# EAGLE design brick_i2c_battery (EAGLE 7.2.0)
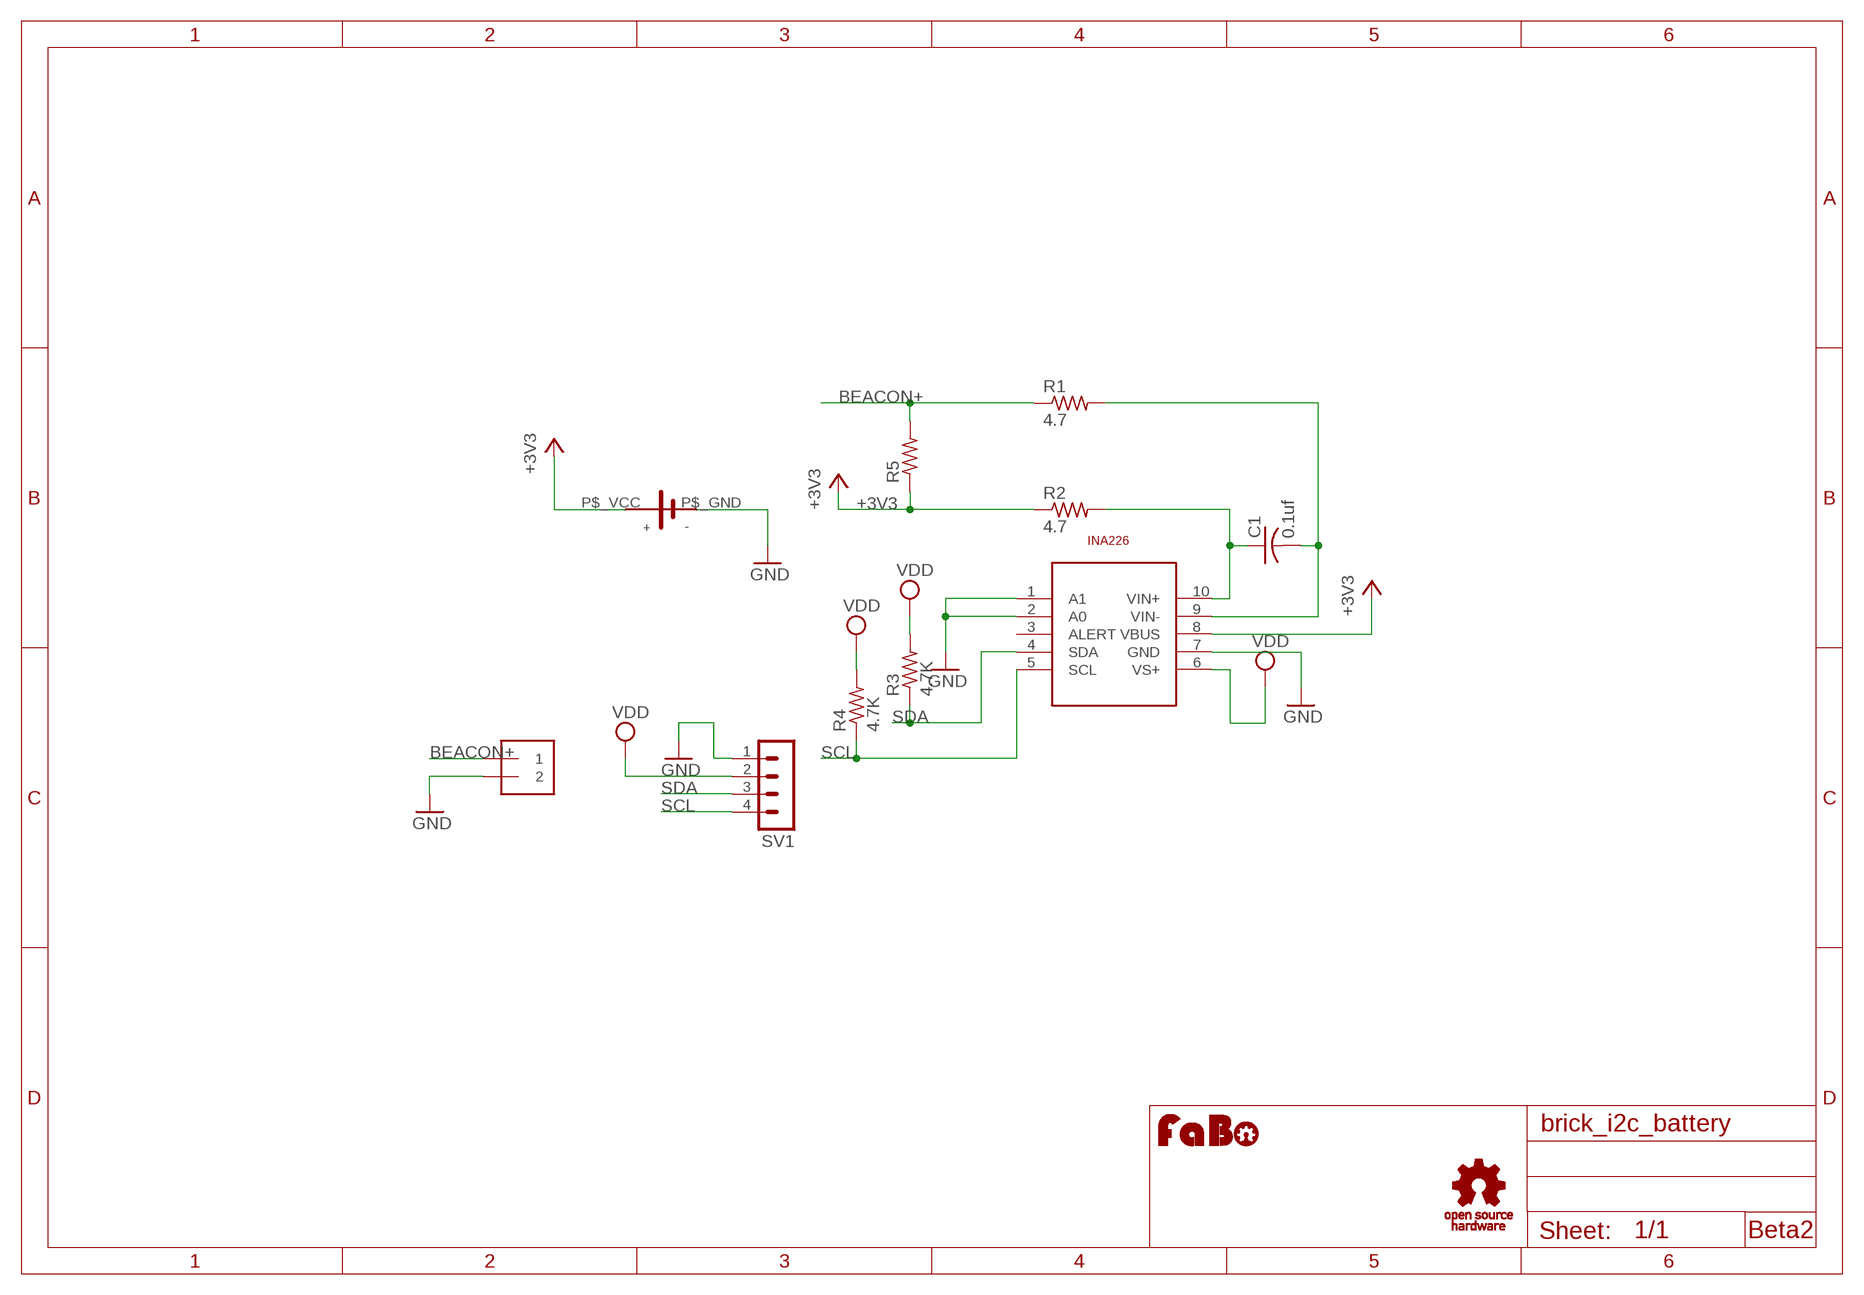
[diagram p0: schematic, sheet 1]

## Parts
C1  0.1uf  C-USC0603  [C0603]
INA1  TI-INA226  [TI-INA226]
J1  1X2-3.5MM  [1X2-3.5MM]
R1  4.7  R-US_R0603  [R0603]
R2  4.7  R-US_R0603  [R0603]
R3  4.7K  R-US_R0603  [R0603]
R4  4.7K  R-US_R0603  [R0603]
R5  R-US_R6332  [R6332]
SV1  MA04-1  [MA04-1]
U$2  SMTU2450  [SMTU2450]
U$3  LOGO_FABO-S  [LOGO_FABO_S]
U$4  LOGO_OSHW_T-S  [LOGO_OSHW_T_S]

## Nets
+3V3: INA1.8(VBUS) R2.1 R5.1 U$2.P$_VCC
BEACON+: J1.1 R1.1 R5.2
GND: INA1.1(A1) INA1.2(A0) INA1.7(GND) J1.2 SV1.1 U$2.P$_GND
N$3: C1.1 INA1.10(VIN+) R2.2
N$4: C1.2 INA1.9(VIN-) R1.2
SCL: INA1.5(SCL) R4.1 SV1.4
SDA: INA1.4(SDA) R3.1 SV1.3
VDD: INA1.6(VS+) R3.2 R4.2 SV1.2
Unconnected: INA1.3(ALERT)

## Notes on the sheet
- Beta2

## Library data of the parts
C1 = adafruit:C-US: CAPACITOR, American symbol
INA1 = gclueSensor:TI-INA226
J1 = adafruit:1X2: 3.5mm Terminal block http://www.ladyada.net/library/pcb/eaglelibrary.html
R1-R5 = adafruit:R-US_: RESISTOR, American symbol
SV1 = con-lstb:MA04-1: PIN HEADER; OC_FARNELL: unknown; OC_NEWARK: unknown
U$2 = gclue:SMTU2450
U$3 = FaBo:LOGO_FABO
U$4 = gclue:LOGO_OSHW_T

## Board
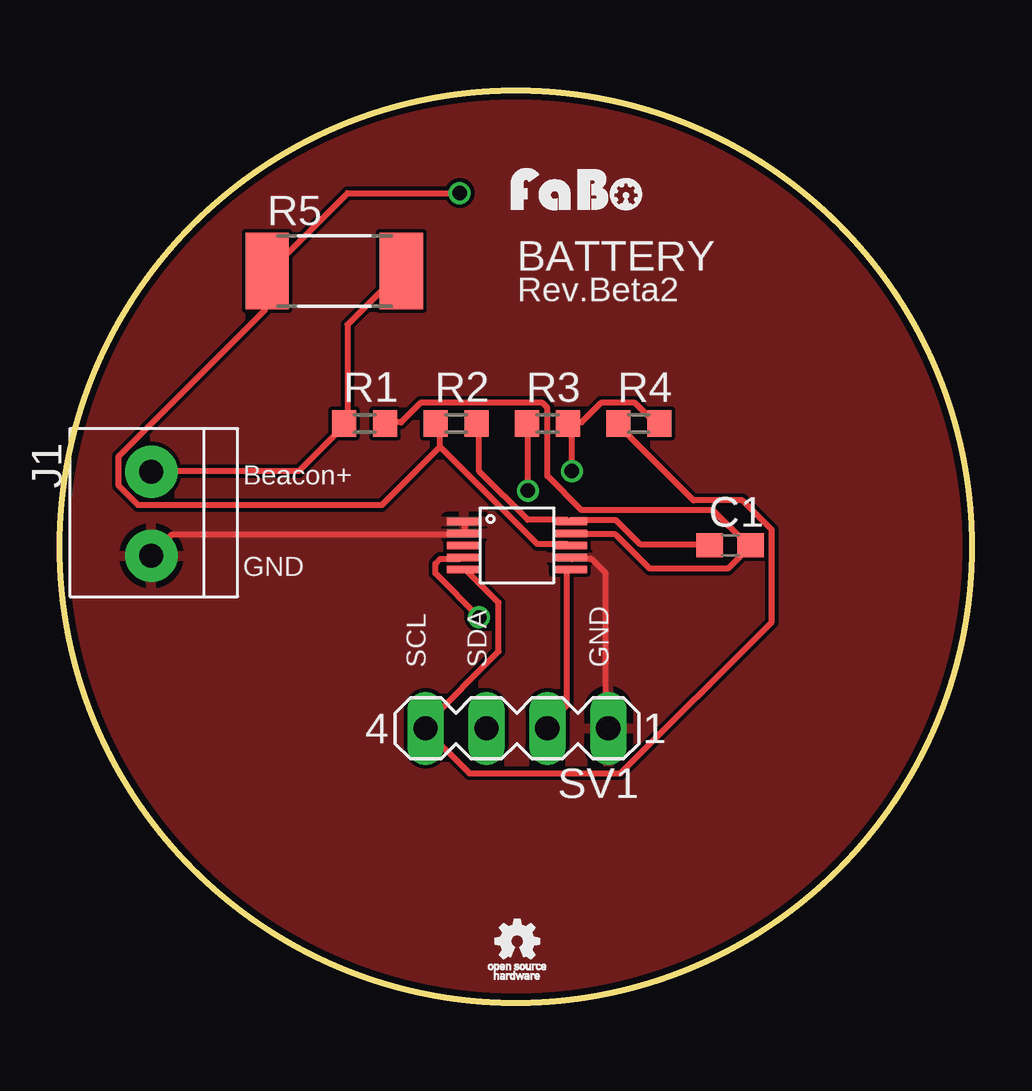
[diagram p1: board, top side]
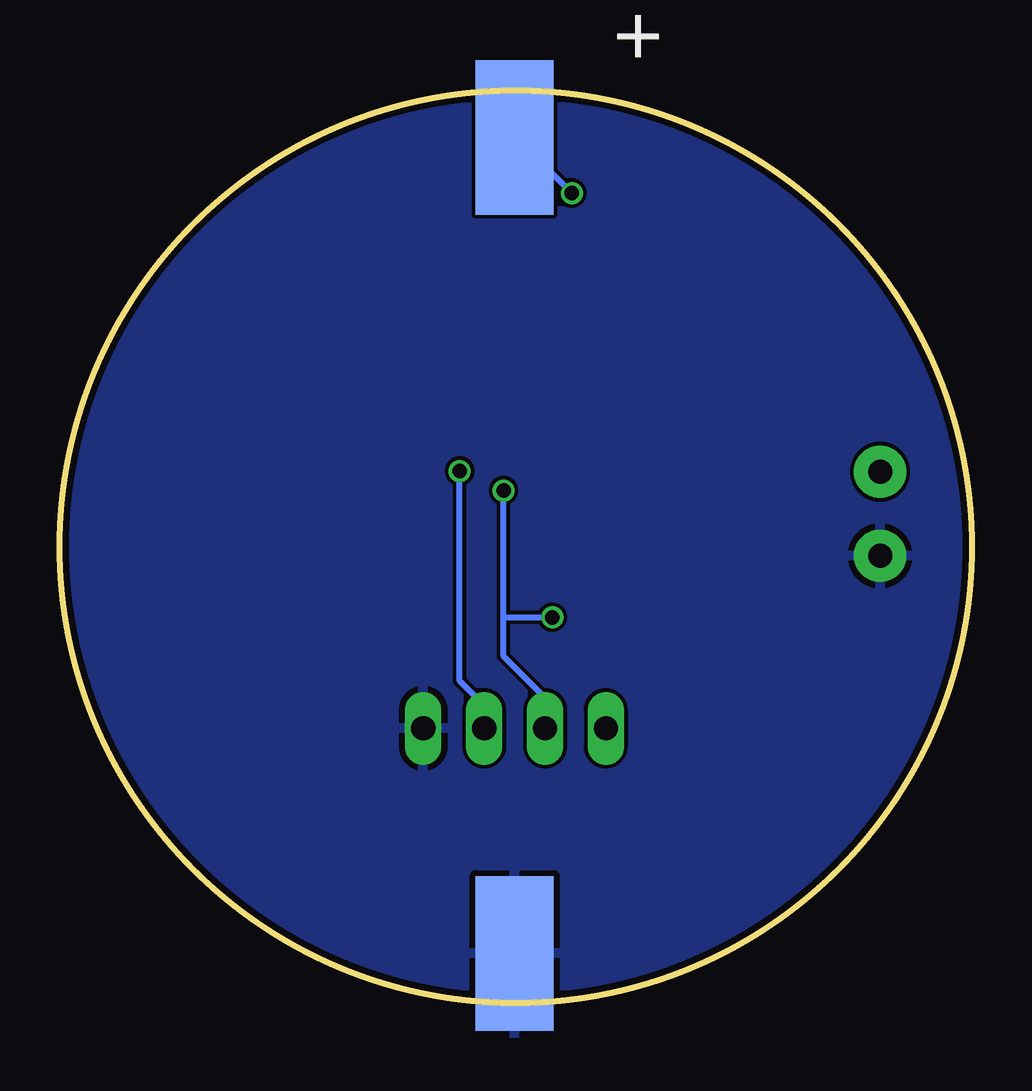
[diagram p2: board, bottom side, seen from below]

Size 38 x 38 mm. Coordinates in mm from the lower left corner, seen from the top.
Outline: circle at 19,19 radius 19
Copper layers (1*16): Top 0.035mm / dielectric 1.5mm / Bottom 0.035mm
Design rules "Elecrow_2-layer_eagle_rule": minimum track width 6mil, minimum drill 12mil, track to track 6mil, track to pad 6mil, pad to pad 6mil, via to via 6mil, smd to smd 0mil, copper to edge 10mil, drill to drill 10mil, minimum pad ring 10mil, minimum via ring 6mil, stop-mask expansion 2mil, vias tented up to drill 100mil, thermal gap 10mil

### Footprints (pad centres in the part's own frame; a part is rotated, then mirrored left to right if it is on the bottom)
C0603 = smd 1.1 x 1: 1 -0.85,0; 2 0.85,0
TI-INA226 = smd 1.45 x 0.3: 1 -2.2,1; 2 -2.2,0.5; 3 -2.2,0; 4 -2.2,-0.5; 5 -2.2,-1; 6 2.2,-1; 7 2.2,-0.5; 8 2.2,0; 9 2.2,0.5; 10 2.2,1
1X2-3.5MM = drill 1 pad 2.184: 1 1.8,0; 2 -1.7,0
R0603 = smd 1 x 1.1: 1 -0.85,0; 2 0.85,0
R6332 = smd 1.8 x 3.2: 1 -2.8,0; 2 2.8,0
MA04-1 = drill 1.016 long: 1 -3.81,0; 2 -1.27,0; 3 1.27,0; 4 3.81,0
SMTU2450 = smd 3.251 x 6.452 bottom: P$_GND 0,-17; P$_VCC 0,17

### Placement (x,y rotation side)
C1  27.94,19.05 0 top
INA1  19.05,19.05 0 top
J1  3.81,20.32 90 top
R1  12.7,24.13 0 top
R2  16.51,24.13 0 top
R3  20.32,24.13 0 top
R4  24.13,24.13 0 top
R5  11.43,30.48 0 top
SV1  19.05,11.43 180 top
U$2  19.05,19.05 0 top
U$3  21.59,33.02 0 top
U$4  19.05,2.54 0 top

### Tracks (layer width: path | path; a pad name or v marks a point on that pad's centre or on a via)
+3V3  (via drill 0.61)
  Top 0.254: 15.85,23.16 15.85,23.98 R2.1 | 15.85,23.16 19.91,19.1 21.13,19.1 INA1.8 | 15.85,23.16 13.41,20.73 3.25,20.73 2.44,21.54 2.44,22.76 8.53,28.85 8.53,30.48 R5.1 8.74,30.48 11.99,33.73 v16.66,33.73
  Bottom 0.254: v16.66,33.73 18.9,35.97 U$2.P$_VCC
BEACON+
  Top 0.254: R5.2 11.99,28.25 11.99,24.18 R1.1 11.79,23.98 9.96,22.15 3.86,22.15 J1.1
GND
  Top 0.254: INA1.1 16.87,19.91 16.87,19.51 INA1.2 16.66,19.51 4.67,19.51 3.86,18.69 J1.2 | INA1.7 21.34,18.49 22.15,18.49 22.76,17.88 22.76,11.58 SV1.1
  pour Bottom: -1.27,-1.27 39.37,-1.27 39.37,39.37 -1.27,39.37
  pour Top: -1.27,-1.27 39.37,-1.27 39.37,39.37 -1.27,39.37
N$3
  Top 0.254: C1.1 27.03,19.1 24.18,19.1 23.16,20.12 21.34,20.12 INA1.10 21.13,20.12 19.51,20.12 17.48,22.15 17.48,23.98 R2.2
N$4
  Top 0.254: R1.2 13.61,24.18 14.22,24.18 15.04,24.99 20.12,24.99 20.32,24.79 20.32,21.95 21.74,20.52 27.23,20.52 28.65,19.1 C1.2 28.65,18.9 27.84,18.09 24.59,18.09 23.16,19.51 21.34,19.51 INA1.9
SCL
  Top 0.254: R4.1 23.37,23.98 26.42,20.93 28.45,20.93 29.67,19.71 29.67,15.85 23.37,9.55 17.07,9.55 15.24,11.38 SV1.4 15.24,11.58 18.29,14.63 18.29,16.66 16.87,18.09 INA1.5
SDA  (via drill 0.61)
  Top 0.254: v19.51,21.34 19.51,23.98 R3.1 | v17.48,16.05 15.65,17.88 15.65,18.29 15.85,18.49 16.66,18.49 INA1.4
  Bottom 0.254: 19.51,16.05 19.51,14.43 17.88,12.8 17.88,11.58 SV1.3 | 19.51,16.05 v19.51,21.34 | 19.51,16.05 v17.48,16.05
VDD  (via drill 0.61)
  Top 0.254: R4.2 24.79,24.18 23.98,24.99 22.55,24.99 21.74,24.18 21.34,24.18 R3.2 21.34,23.98 v21.34,22.15 | INA1.6 21.13,18.09 21.13,12.39 20.32,11.58 SV1.2
  Bottom 0.254: v21.34,22.15 21.34,13.41 20.32,12.39 SV1.2

### Text on the board
tPlace: BATTERY | Rev.Beta2 | Beacon+ | GND | SCL | SDA | GND